# Altium schematic sheet LTC2194_1.SchDoc
size A; SheetNumber: 6; SheetTotal: 24
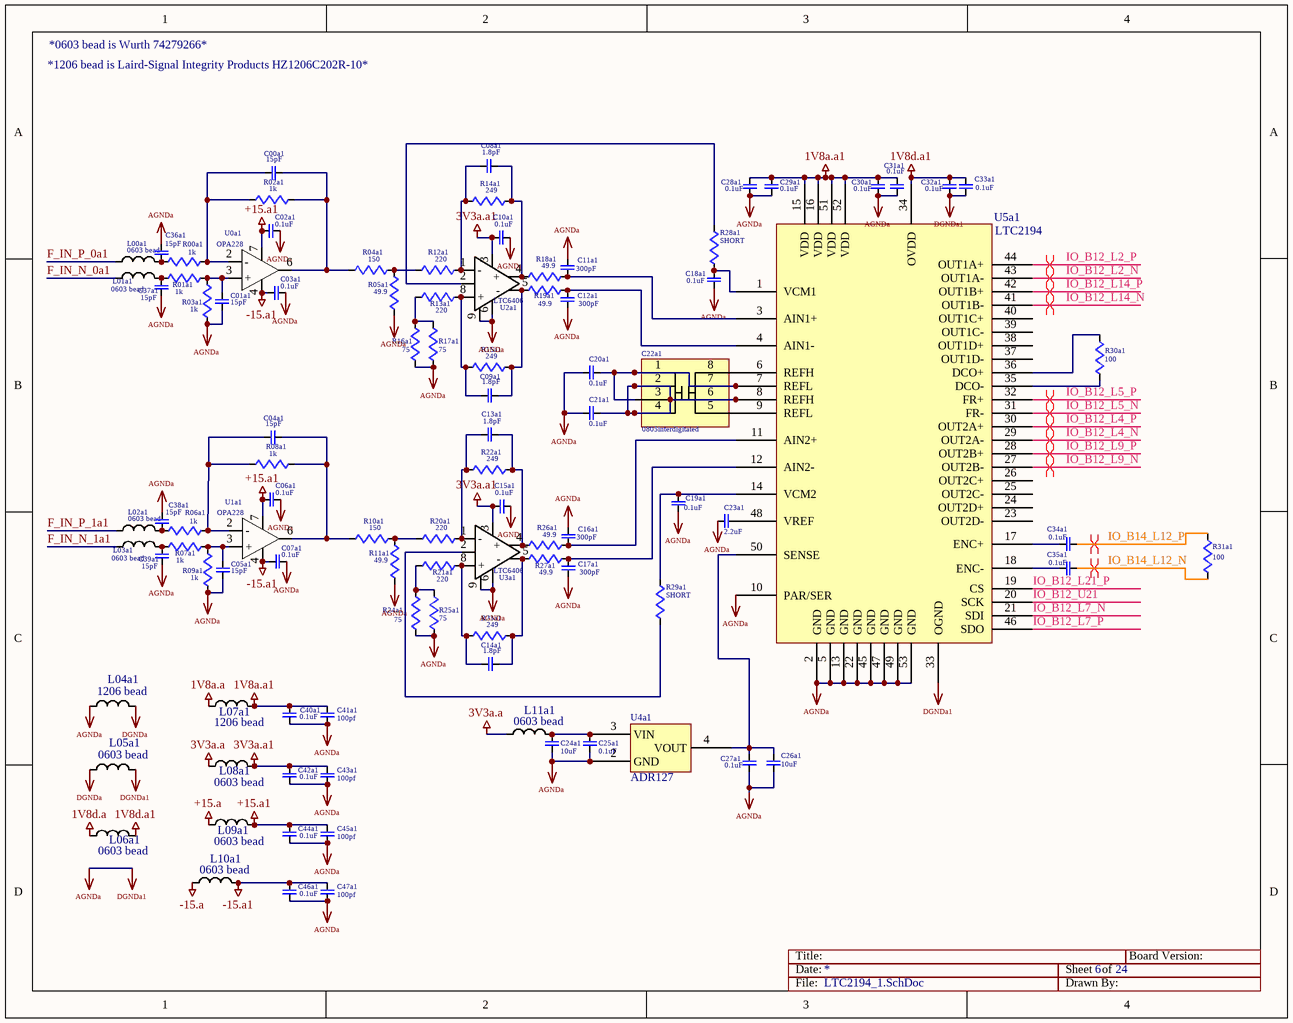
[diagram p0: LTC2194_1.SchDoc]

## Parts
C00a1  15pF  [0603]
C01a1  15pF  [0603]
C02a1  0.1uF  [0603]
C03a1  0.1uF  [0603]
C04a1  15pF  [0603]
C05a1  15pF  [0603]
C06a1  0.1uF  [0603]
C07a1  0.1uF  [0603]
C08a1  1.8pF  [0603]
C09a1  1.8pF  [0603]
C10a1  0.1uF  [0603]
C11a1  300pF  [0603]
C12a1  300pF  [0603]
C13a1  1.8pF  [0603]
C14a1  1.8pF  [0603]
C15a1  0.1uF  [0603]
C16a1  300pF  [0603]
C17a1  300pF  [0603]
C18a1  0.1uF  [0402]
C19a1  0.1uF  [0402]
C20a1  0.1uF  [0402]
C21a1  0.1uF  [0402]
C22a1  0805interdigitated  [0805int]
C23a1  2.2uF  [0402]
C24a1  10uF  [0603]
C25a1  0.1uF  [0603]
C26a1  10uF  [0603]
C27a1  0.1uF  [0603]
C28a1  0.1uF  [0402]
C29a1  0.1uF  [0402]
C30a1  0.1uF  [0402]
C31a1  0.1uF  [0402]
C32a1  0.1uF  [0402]
C33a1  0.1uF  [0402]
C34a1  0.1uF  [0402]
C35a1  0.1uF  [0402]
C36a1  15pF  [0603]
C37a1  15pF  [0603]
C38a1  15pF  [0603]
C39a1  15pF  [0603]
C40a1  0.1uF  [0603]
C41a1  100pf  [0603]
C42a1  0.1uF  [0603]
C43a1  100pf  [0603]
C44a1  0.1uF  [0603]
C45a1  100pf  [0603]
C46a1  0.1uF  [0603]
C47a1  100pf  [0603]
L00a1  0603 bead  [0603]
L01a1  0603 bead  [0603]
L02a1  0603 bead  [0603]
L03a1  0603 bead  [0603]
L04a1  1206 bead  [1206]
L05a1  0603 bead  [0603]
L06a1  0603 bead  [0603]
L07a1  1206 bead  [1206]
L08a1  0603 bead  [0603]
L09a1  0603 bead  [0603]
L10a1  0603 bead  [0603]
L11a1  0603 bead  [0603]
R00a1  1k  [0603]
R01a1  1k  [0603]
R02a1  1k  [0603]
R03a1  1k  [0603]
R04a1  150  [0603]
R05a1  49.9  [0603]
R06a1  1k  [0603]
R07a1  1k  [0603]
R08a1  1k  [0603]
R09a1  1k  [0603]
R10a1  150  [0603]
R11a1  49.9  [0603]
R12a1  220  [0603]
R13a1  220  [0603]
R14a1  249  [0603]
R15a1  249  [0603]
R16a1  75  [0603]
R17a1  75  [0603]
R18a1  49.9  [0603]
R19a1  49.9  [0603]
R20a1  220  [0603]
R21a1  220  [0603]
R22a1  249  [0603]
R23a1  249  [0603]
R24a1  75  [0603]
R25a1  75  [0603]
R26a1  49.9  [0603]
R27a1  49.9  [0603]
R28a1  SHORT  [0603]
R29a1  SHORT  [0603]
R30a1  100  [0603]
R31a1  100  [0402]
U0a1  OPA228  [8SOIC]
U1a1  OPA228  [8SOIC]
U2a1  LTC6406  [8MSOP]
U3a1  LTC6406  [8MSOP]
U4a1  ADR127  [6TSOT]
U5a1  LTC2194  [52QFN]

## Nets
1V8a.a: L07a1.1
1V8a.a1: C28a1.1 C29a1.1 C30a1.1 C31a1.1 C40a1.1 C41a1.1 L07a1.2 U5a1.15(VDD) U5a1.16(VDD) U5a1.51(VDD) U5a1.52(VDD)
1V8d.a: L06a1.1
1V8d.a1: C32a1.1 C33a1.2 L06a1.2 U5a1.34(OVDD)
3V3a.a: L08a1.1 L11a1.1
3V3a.a1: C10a1.1 C15a1.1 C42a1.1 C43a1.1 L08a1.2 U2a1.3(V+) U3a1.3(V+)
+15.a: L09a1.1
+15.a1: C02a1.2 C06a1.2 C44a1.1 C45a1.1 L09a1.2 U0a1.7(V+) U1a1.7(V+)
-15.a: L10a1.1
-15.a1: C03a1.2 C07a1.2 C46a1.1 C47a1.1 L10a1.2 U0a1.4(V-) U1a1.4(V-)
AGNDa: C01a1.2 C02a1.1 C03a1.1 C05a1.2 C06a1.1 C07a1.1 C10a1.2 C11a1.2 C12a1.1 C15a1.2 C16a1.2 C17a1.1 C18a1.1 C19a1.1 C20a1.2 C21a1.2 C23a1.2 C24a1.2 C25a1.2 C26a1.2 C27a1.2 C28a1.2 C29a1.2 C30a1.2 C31a1.2 C32a1.2 C33a1.1 C36a1.1 C37a1.2 C38a1.1 C39a1.2 C40a1.2 C41a1.2 C42a1.2 C43a1.2 C44a1.2 C45a1.2 C46a1.2 C47a1.2 L04a1.1 L05a1.2 R03a1.1 R05a1.2 R09a1.1 R11a1.2 R16a1.2 R17a1.2 R24a1.2 R25a1.2 U2a1.6(V-) U2a1.9(V-) U3a1.6(V-) U3a1.9(V-) U4a1.2(GND) U5a1.2(GND) U5a1.5(GND) U5a1.10(PAR/SER) U5a1.13(GND) U5a1.22(GND) U5a1.33(OGND) U5a1.45(GND) U5a1.47(GND) U5a1.49(GND) U5a1.53(GND)  [also labelled DGNDa1]
DGNDa: L04a1.2 L05a1.1
F_IN_N_0a1: L01a1.1
F_IN_N_1a1: L03a1.1
F_IN_P_0a1: L00a1.1
F_IN_P_1a1: L02a1.1
IO_B12_L2_N: U5a1.43(OUT1A-)
IO_B12_L2_P: U5a1.44(OUT1A+)
IO_B12_L4_N: U5a1.29(OUT2A-)
IO_B12_L4_P: U5a1.30(OUT2A+)
IO_B12_L5_N: U5a1.31(FR-)
IO_B12_L5_P: U5a1.32(FR+)
IO_B12_L7_N: U5a1.21(SDI)
IO_B12_L7_P: U5a1.46(SDO)
IO_B12_L9_N: U5a1.27(OUT2B-)
IO_B12_L9_P: U5a1.28(OUT2B+)
IO_B12_L14_N: U5a1.41(OUT1B-)
IO_B12_L14_P: U5a1.42(OUT1B+)
IO_B12_L21_P: U5a1.19(CS)
IO_B12_U21: U5a1.20(SCK)
IO_B14_L12_N: C35a1.1 R31a1.2
IO_B14_L12_P: C34a1.1 R31a1.1
NetC00a1_1: C00a1.1 R00a1.1 R02a1.2 U0a1.2(-)
NetC00a1_2: C00a1.2 R02a1.1 R04a1.2 U0a1.6(OUT)
NetC01a1_1: C01a1.1 R01a1.1 R03a1.2 U0a1.3(+)
NetC04a1_1: C04a1.1 R06a1.1 R08a1.2 U1a1.2(-)
NetC04a1_2: C04a1.2 R08a1.1 R10a1.2 U1a1.6(OUT)
NetC05a1_1: C05a1.1 R07a1.1 R09a1.2 U1a1.3(+)
NetC08a1_1: C08a1.1 R12a1.1 R14a1.2 U2a1.1(-)
NetC08a1_2: C08a1.2 R14a1.1 R18a1.2 U2a1.4(+)
NetC09a1_1: C09a1.1 R13a1.1 R15a1.2 U2a1.8(+)
NetC09a1_2: C09a1.2 R15a1.1 R19a1.2 U2a1.5(-)
NetC11a1_1: C11a1.1 R18a1.1 U5a1.3(AIN1+)
NetC12a1_2: C12a1.2 R19a1.1 U5a1.4(AIN1-)
NetC13a1_1: C13a1.1 R20a1.1 R22a1.2 U3a1.1(-)
NetC13a1_2: C13a1.2 R22a1.1 R26a1.2 U3a1.4(+)
NetC14a1_1: C14a1.1 R21a1.1 R23a1.2 U3a1.8(+)
NetC14a1_2: C14a1.2 R23a1.1 R27a1.2 U3a1.5(-)
NetC16a1_1: C16a1.1 R26a1.1 U5a1.11(AIN2+)
NetC17a1_2: C17a1.2 R27a1.1 U5a1.12(AIN2-)
NetC18a1_2: C18a1.2 R28a1.2 U5a1.1(VCM1)
NetC19a1_2: C19a1.2 R29a1.1 U5a1.14(VCM2)
NetC20a1_1: C20a1.1 C22a1.1 C22a1.3 C22a1.7 U5a1.7(REFL)
NetC21a1_1: C21a1.1 C22a1.2 C22a1.4 C22a1.6 U5a1.8(REFH)
NetC22a1_5: C22a1.5 U5a1.9(REFL)
NetC22a1_8: C22a1.8 U5a1.6(REFH)
NetC23a1_1: C23a1.1 U5a1.48(VREF)
NetC24a1_1: C24a1.1 C25a1.1 L11a1.2 U4a1.3(VIN)
NetC26a1_1: C26a1.1 C27a1.1 U4a1.4(VOUT) U5a1.50(SENSE)
NetC34a1_2: C34a1.2 U5a1.17(ENC+)
NetC35a1_2: C35a1.2 U5a1.18(ENC-)
NetC36a1_2: C36a1.2 L00a1.2 R00a1.2
NetC37a1_1: C37a1.1 L01a1.2 R01a1.2
NetC38a1_2: C38a1.2 L02a1.2 R06a1.2
NetC39a1_1: C39a1.1 L03a1.2 R07a1.2
NetR04a1_1: R04a1.1 R05a1.1 R12a1.2
NetR10a1_1: R10a1.1 R11a1.1 R20a1.2
NetR13a1_2: R13a1.2 R16a1.1 R17a1.1
NetR21a1_2: R21a1.2 R24a1.1 R25a1.1
NetR28a1_1: R28a1.1 U2a1.2(VOCM)
NetR29a1_2: R29a1.2 U3a1.2(VOCM)
NetR30a1_1: R30a1.1 U5a1.36(DCO+)
NetR30a1_2: R30a1.2 U5a1.35(DCO-)

Not connected (* = marked no-connect by the designer): U5a1 23(OUT2D-) 24(OUT2D+) 25(OUT2C-) 26(OUT2C+) 37(OUT1D-) 38(OUT1D+) 39(OUT1C-) 40(OUT1C+)

## Layout directives
differential pair: IO_B12_L2_N, IO_B12_L2_P, IO_B12_L4_N, IO_B12_L4_P, IO_B12_L5_N, IO_B12_L5_P, IO_B12_L9_N, IO_B12_L9_P, IO_B12_L14_N, IO_B12_L14_P, IO_B14_L12_N, IO_B14_L12_P

## Notes on the sheet
- *1206 bead is Laird-Signal Integrity Products HZ1206C202R-10*
- *0603 bead is Wurth 74279266*
- Title:
- Date:
- Sheet
- of
- Board Version:
- File:
- Drawn By:

## Library data of the parts
C00a1 C01a1 C02a1 C03a1 C04a1 C05a1 C06a1 C07a1 C08a1 C09a1 C10a1 C11a1 C12a1 C13a1 C14a1 C15a1 C16a1 C17a1 C18a1 C19a1 C20a1 C21a1 C23a1 C24a1 C25a1 C26a1 C27a1 C28a1 C29a1 C30a1 C31a1 C32a1 C33a1 C34a1 C35a1 C36a1 C37a1 C38a1 C39a1 C40a1 C41a1 C42a1 C43a1 C44a1 C45a1 C46a1 C47a1 = CAP
C22a1 = 0805intCap
L00a1 L01a1 L02a1 L03a1 L04a1 L05a1 L06a1 L07a1 L08a1 L09a1 L10a1 L11a1 = INDUCTOR
R00a1 R01a1 R02a1 R03a1 R04a1 R05a1 R06a1 R07a1 R08a1 R09a1 R10a1 R11a1 R12a1 R13a1 R14a1 R15a1 R16a1 R17a1 R18a1 R19a1 R20a1 R21a1 R22a1 R23a1 R24a1 R25a1 R26a1 R27a1 R28a1 R29a1 R30a1 R31a1 = RES
U0a1 U1a1 = LF356
U4a1 = ADR12x